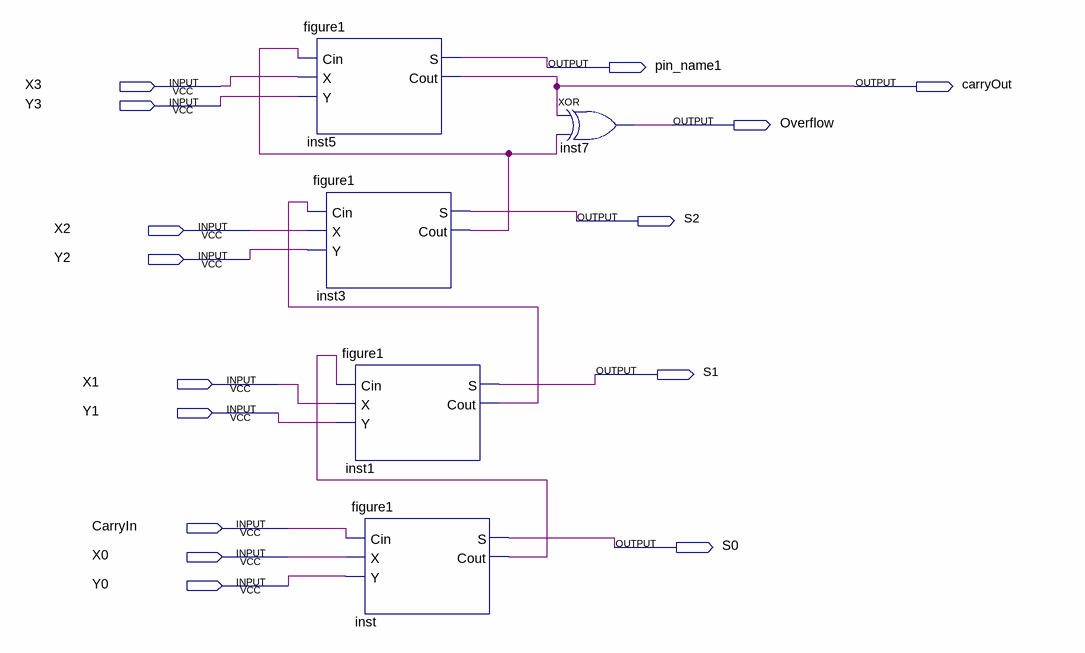
[diagram p0: schematic sheet]
// Quartus schematic figure2.bdf as structural Verilog: 5 symbols, 15 pins
module figure2 (
  input  X3,
  input  Y3,
  input  X2,
  input  Y2,
  input  X1,
  input  Y1,
  input  CarryIn,
  input  X0,
  input  Y0,
  output pin_name1,
  output carryOut,
  output Overflow,
  output S2,
  output S1,
  output S0
);

  wire inst1_cout, inst3_cout, inst_cout;

  figure1 inst5 (.Cin(inst3_cout), .X(X3), .Y(Y3), .S(pin_name1), .Cout(carryOut));
  figure1 inst3 (.Cin(inst1_cout), .X(X2), .Y(Y2), .S(S2), .Cout(inst3_cout));
  figure1 inst1 (.Cin(inst_cout), .X(X1), .Y(Y1), .S(S1), .Cout(inst1_cout));
  figure1 inst (.Cin(CarryIn), .X(X0), .Y(Y0), .S(S0), .Cout(inst_cout));
  xor inst7 (Overflow, carryOut, inst3_cout);
endmodule
